# EasyEDA Pro project ProProject_FYP_2025-03-13.epro

# Schematic schematic1
Create Date: 2024-09-28; Page Name: P1; Project Name: FYP; Schematic Name: schematic1; Update Date: 2024-12-18; Company: 专业综合设计2024-1B组; Drawed: 张硕; Page Size: 张硕; Part Number: none; Reviewed: zs; Version: V2.0
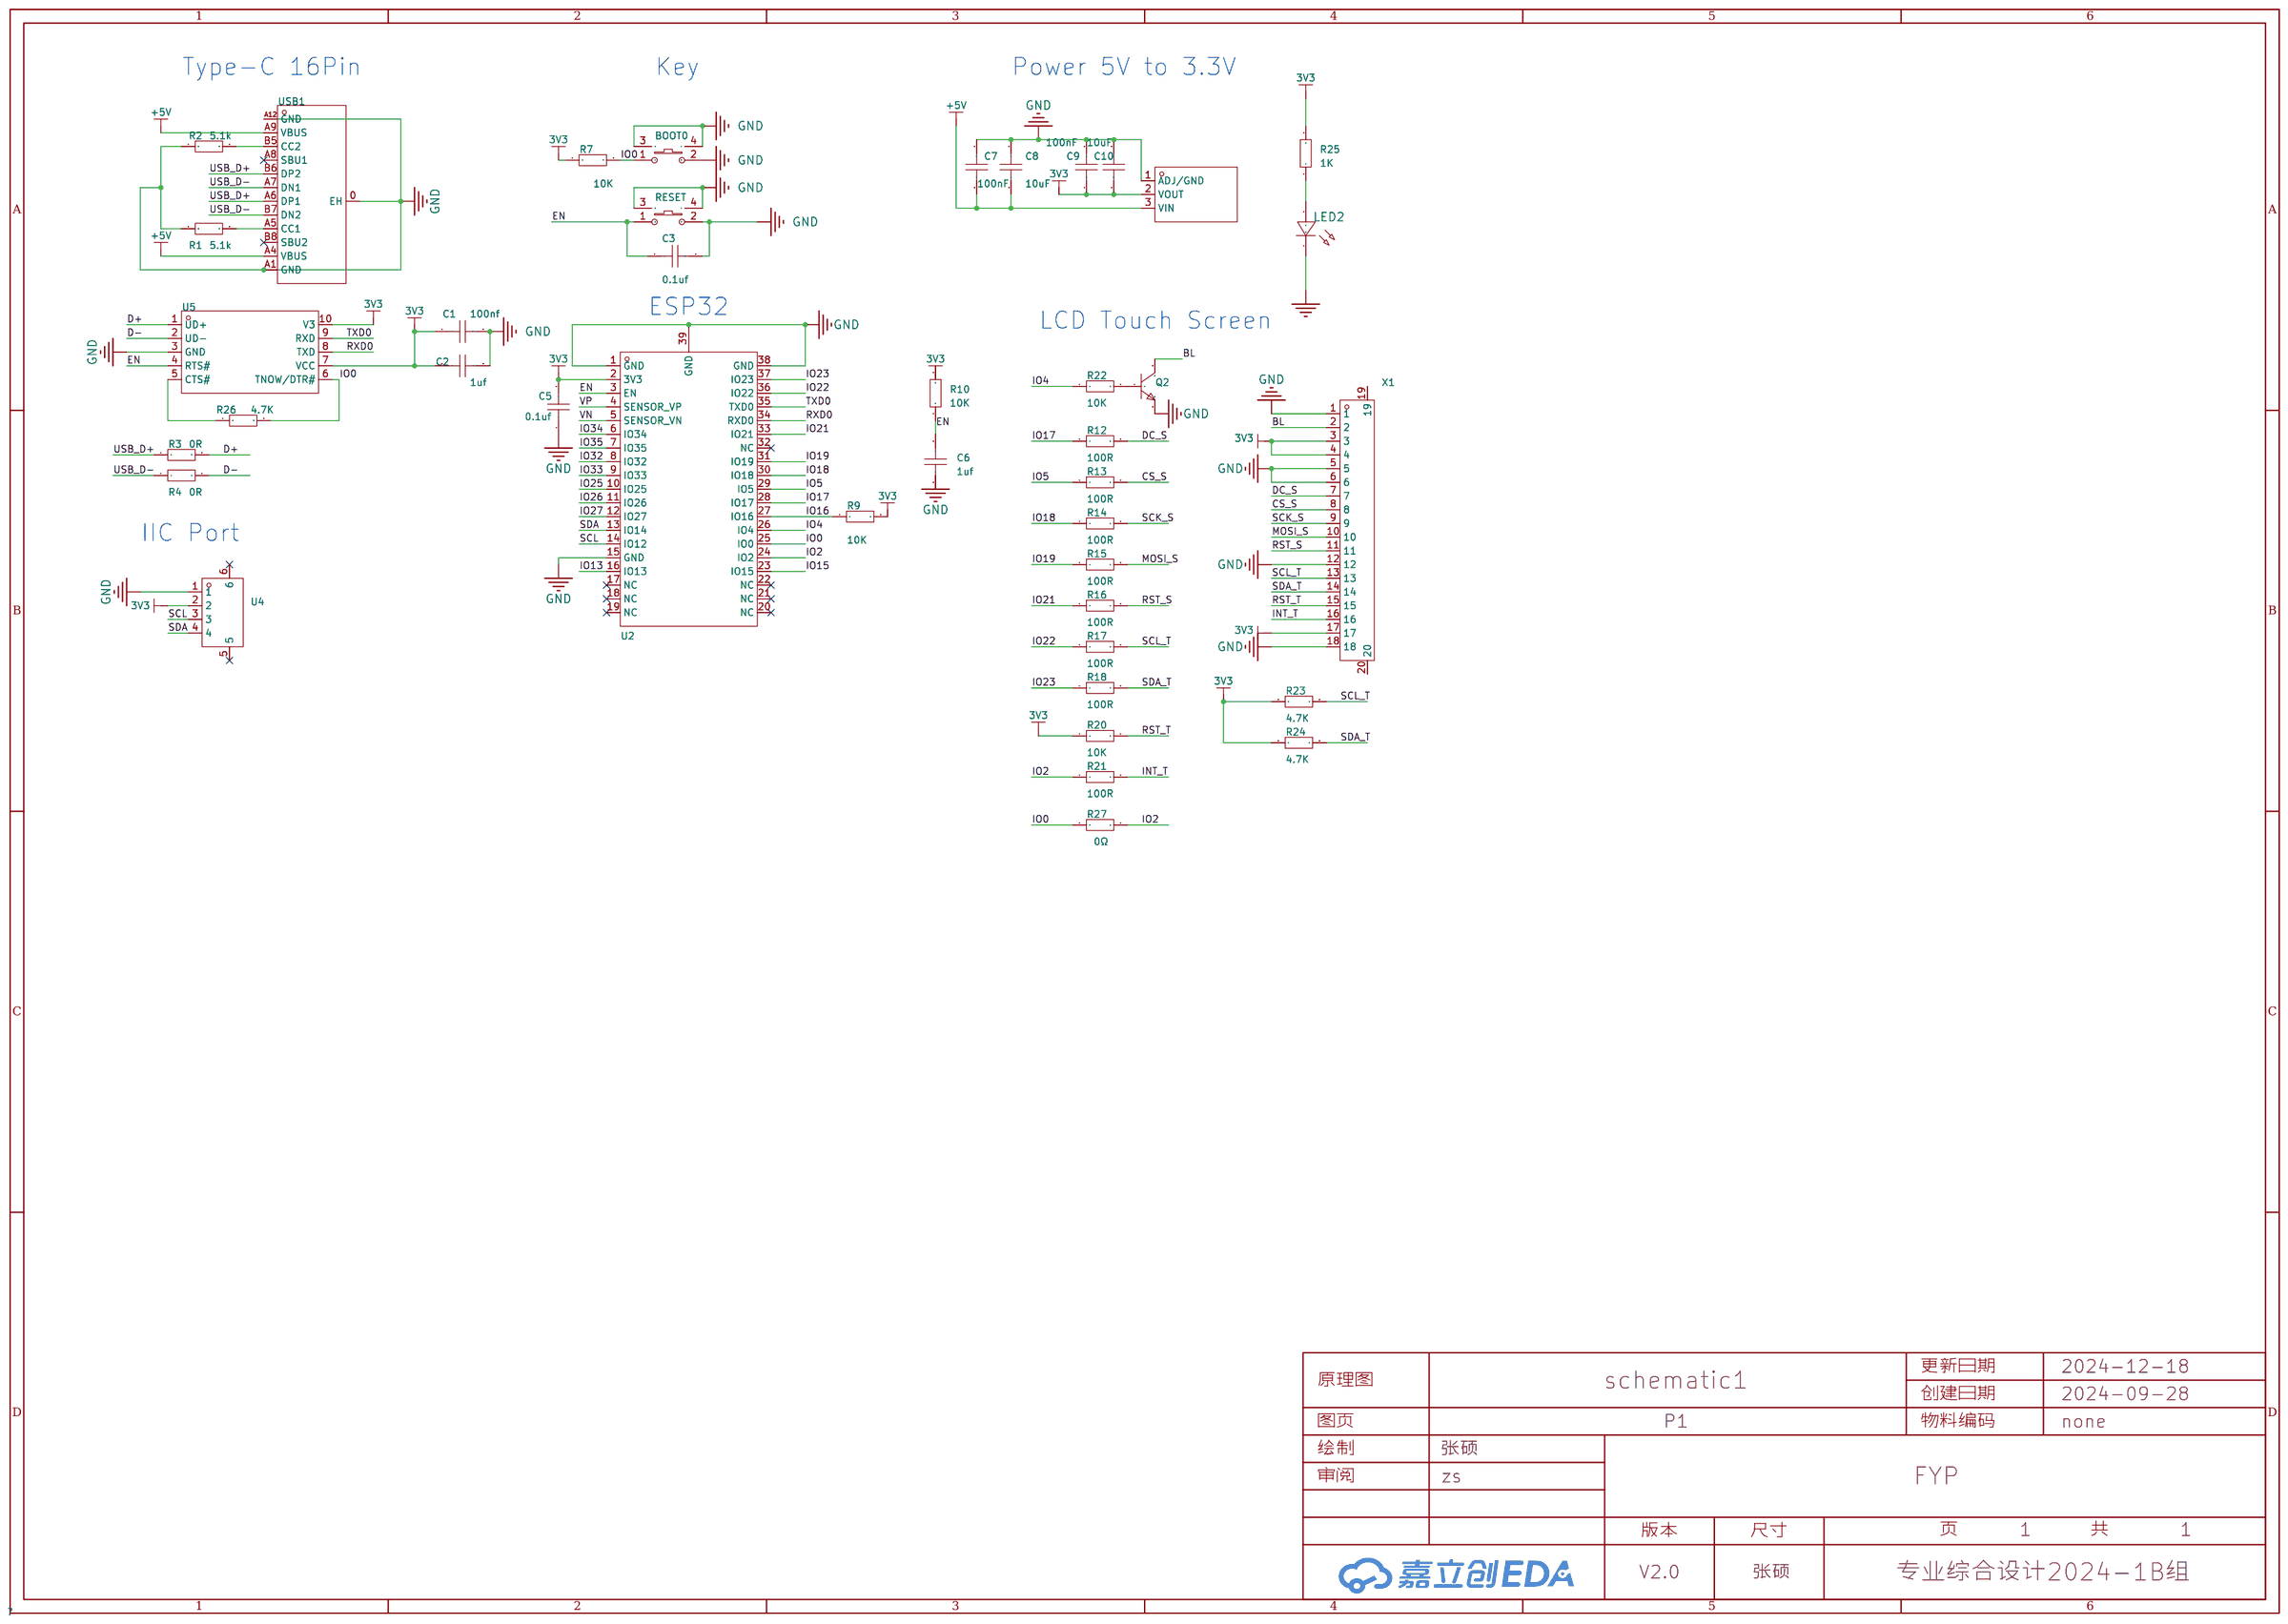
[diagram p0: schematic sheet]

## Parts
BOOT0  TS24CA 250gf 013  [SW-SMD_L4.7-W3.5-P3.35-EH]
C1  100nf  [C0603]
C2  1uf  [C0603]
C3  0.1uf  [C0603]
C5  0.1uf  [C0603]
C6  1uf  [C0603]
C7  100nF  [C0603]
C8  10uF  [C0603]
C9  100nF  [C0603]
C10  10uF  [C0603]
LED2  -  [LED_0603]
Q2  -  [S8050_SOT-23]
Q4  AMS1117-3.3V  [SOT-89-3_L4.5-W2.5-P1.50-LS4.2-BR]
R1  5.1k  [R0603]
R2  5.1k  [R0603]
R3  0R  [R0603]
R4  0R  [R0603]
R7  10K  [R0603]
R9  10K  [R0603]
R10  10K  [R0603]
R12  100R  [R0603]
R13  100R  [R0603]
R14  100R  [R0603]
R15  100R  [R0603]
R16  100R  [R0603]
R17  100R  [R0603]
R18  100R  [R0603]
R20  10K  [R0603]
R21  100R  [R0603]
R22  10K  [R0603]
R23  4.7K  [R0603]
R24  4.7K  [R0603]
R25  1K  [R0603]
R26  4.7K  [R0603]
R27  0Ω  [R0603]
RESET  TS24CA 250gf 013  [SW-SMD_L4.7-W3.5-P3.35-EH]
U2  ESP32-WROOM-32E-N4  [WIFI-SMD_ESP32-WROOM-32E]
U4  WAFER-GH1.25-4PWB  [CONN-SMD_4P-P1.25_XUNPU_WAFER-GH1.25-4PWB]
U5  CH340X  [MSOP-10_L3.0-W3.0-P0.50-LS5.0-BL]
USB1  TYPE-C 16P QTWT  [USB-TYPE-C-SMD_TYPE-C-16P-QTWT]
X1  AFC07-S18FCA-00  [FPC-SMD_AFC07-S18FCA-00]

## Library data of the parts
BOOT0 RESET = TS24CA 250gf 013: 电路结构:单刀单掷;按钮形状:矩形按钮;作用力:250gf;安装方式:卧贴;开关长度:4.55mm;开关宽度:1.8mm;开关高度:3.5mm;带支架:不带;触点电流:50mA;额定电压(AC):-;额定电压(DC):12V;额定功率:0.6W;绝缘电阻:100MΩ;带灯:无;机械寿命:3万次;; LCSC Part Name: 2*4*3.5mm半包小贝贝TS-018小侧按键m165蓝牙耳机开关 250gf; Supplier Part: C5373430; Manufacturer: SHOU HAN(首韩); Supplier Footprint: SMD; JLCPCB Part Class: 扩展库; Datasheet: https://atta.szlcsc.com/upload/public/pdf/source/20230321/913029B0FB0CD391AF5EFD51697D8EC4.pdf; Supplier: LCSC; Circuit: 单刀单掷; Actuator Style: 矩形按钮; Operating Force: 250gf; Mounting Style: 卧贴; Switch Length: 4.55mm; Switch Width: 1.8mm; Switch Height: 3.5mm; Strike Gundam: 不带; Contact Current: 50mA; Voltage Rating (DC): 12V; Power Rating: 0.6W; Insulation Resistance: 100MΩ; Actuator/Cap Color: 黑色; With Lamp: 无; Mechanical Life: 3万次; Operating Temperature: -40℃~+85℃
C1-C3 C5 C6 R1-R4 R7 R9 R10 R12-R18 R20-R27 = Res_0603: Supplier Footprint: 0603
C7-C10 = CAP_0603: Supplier Footprint: 0603
LED2 = LED_0603-R: Supplier Footprint: 0603
Q2 = S8050_SOT_NPN: Supplier Footprint: SOT-23
Q4 = AMS1117-3.3V_C5120796: 输出类型:固定;最大输入电压:18V;输出电压:3.3V;最大输出电流:1A;输出极性:正极;; LCSC Part Name: 输入18V 输出3.3V 1A; Supplier Part: C5120796; Manufacturer: MSKSEMI(美森科); Supplier Footprint: SOT-89; JLCPCB Part Class: 扩展库; Datasheet: https://atta.szlcsc.com/upload/public/pdf/source/20220727/5E62EAC46FFFF83337622C0FBE1B6BF8.pdf; Supplier: LCSC; Output Type: 固定; Maximum Input Voltage: 18V; Output Voltage: 3.3V; MAX Output Current: 1A; Dropout Voltage: 1.4V@(1A); standby current: 12mA; Operating Temperature: 0℃~+125℃; Output Polarity: 正极; Number of Outputs: 1
U2 = ESP32-WROOM-32E-N4: ESP32-WROOM-32E 集成 ESP32-D0WD-V3 芯片，具有高的稳定性和安全性能。; LCSC Part Name: 通用型Wi-Fi+BT+BLE MCU模组; Supplier Part: C701341; Manufacturer: ESPRESSIF(乐鑫); Supplier Footprint: SMD,18x25.5mm; JLCPCB Part Class: 扩展库; Datasheet: https://atta.szlcsc.com/upload/public/pdf/source/20220601/0020821B65DE5740BBACA5FACC5CF3B6.pdf; Supplier: LCSC
U4 = WAFER-GH1.25-4PWB: 插针结构:1x4P;间距:1.25mm;安装方式:卧贴;参考系列:GH;总PIN数:4P;排数:1;每排PIN数:4;额定电流:1A;工作温度范围:-25℃~+85℃;; LCSC Part Name: 1x4P 间距:1.25mm 卧贴 系列:GH; Supplier Part: C3029379; Manufacturer: XUNPU(讯普); Supplier Footprint: SMD,P=1.25mm,卧贴; JLCPCB Part Class: Extended Part; Datasheet: https://atta.szlcsc.com/upload/public/pdf/source/20220527/CB8773BFB0913C3B8ABD62CB38BA101A.pdf; Supplier: LCSC; Pins Structure: 1x4P; Pitch: 1.25mm; Mounting Style: 卧贴; Reference Series: GH; Number of Pins: 4P; Number of Rows: 1; Number of PINs Per Row: 4; Current Rating (Max): 1A; Operating Temperature Range: -25℃~+85℃
U5 = CH340X: Supplier Part: C3035748; Manufacturer: WCH(南京沁恒); Supplier Footprint: MSOP-10; JLCPCB Part Class: 扩展库; Datasheet: https://atta.szlcsc.com/upload/public/pdf/source/20230530/6E401E9554E9F5311886CC8B3F89B62E.pdf; Supplier: LCSC
USB1 = TYPE-C 16P QTWT: 连接器类型:Type-C;标准:USB 3.1;公母:母;安装方式:卧贴;触点数量:16P;端口数量:1;额定电流 - 电源:3A;触头材质:-;触头镀层:-;工作温度范围:-25℃~+85℃;焊接温度(最大值):-;; LCSC Part Name: Type-C 母 卧贴; Supplier Part: C5187472; Manufacturer: SHOU HAN(首韩); Supplier Footprint: SMD; JLCPCB Part Class: 扩展库; Datasheet: https://atta.szlcsc.com/upload/public/pdf/source/20220929/9CA39B32C19F2C1116A695DA9353B6B2.pdf; Supplier: LCSC; Connector Type: Type-C; Standard: USB 3.1; Gender: 母; Mounting Style: 卧贴; Number of Contacts: 16P; Number of Ports: 1; Current Rating - Power (Max): 3A; Operating Temperature Range: -25℃~+85℃; Rated Voltage (Max): 5V; Connect-Disconnect Life: 1万次; Core Colour: 黑色
X1 = AFC07-S18FCA-00: 锁定特性:抽屉式;触点类型:下接;触点数量:18P;间距:0.5mm;安装类型:卧贴;工作温度范围:-;; LCSC Part Name: 间距:0.5mm P数:18P 抽屉式 下接; Supplier Part: C262564; Manufacturer: JS(钜硕电子); Supplier Footprint: SMD,P=0.5mm,卧贴; JLCPCB Part Class: 扩展库; Datasheet: https://atta.szlcsc.com/upload/public/pdf/source/20190726/C11047_78689421E6D6672DE8D11ECCF89B3729.pdf; Supplier: LCSC; Locking Feature: 抽屉式; Contact Type: 下接; Number of Contacts: 18P; Pitch: 0.5mm; Mounting Type: 卧贴; FFC, FCB Thickness: 0.3mm; Height Above Board: 2mm

## Nets
3V3: C1.1 C2.1 C5.2 C9.1 C10.1 Q4.2(VOUT) R7.1 R9.2 R10.2 R20.1 R23.1 R24.1 R25.2 U2.2(3V3) U4.2 U5.7(VCC) U5.10(V3) X1.3 X1.4 X1.17
+5V: C7.1 C8.1 Q4.3(VIN) USB1.A4(VBUS) USB1.A9(VBUS)
GND: BOOT0.2 BOOT0.3 BOOT0.4 C1.2 C2.2 C3.2 C5.1 C6.2 C7.2 C8.2 C9.2 C10.2 LED2.1(C) Q2.2 Q4.1(ADJ/GND) R1.1 R2.1 RESET.2 RESET.3 RESET.4 U2.1(GND) U2.15(GND) U2.38(GND) U2.39(GND) U4.1 U5.3(GND) USB1.0(EH) USB1.A1(GND) USB1.A12(GND) X1.1 X1.5 X1.6 X1.12 X1.18
BL: Q2.3 X1.2
CS_S: R13.2 X1.8
D+: R3.2 U5.1(UD+)
D-: R4.2 U5.2(UD-)
DC_S: R12.2 X1.7
EN: C3.1 C6.1 R10.1 RESET.1 U2.3(EN) U5.4(RTS#)
INT_T: R21.2 X1.16
IO0: BOOT0.1 R7.2 R26.2 R27.1 U2.25(IO0) U5.6(TNOW/DTR#)
IO2: R21.1 R27.2 U2.24(IO2)
IO4: R22.1 U2.26(IO4)
IO5: R13.1 U2.29(IO5)
IO13: U2.16(IO13)
IO15: U2.23(IO15)
IO16: R9.1 U2.27(IO16)
IO17: R12.1 U2.28(IO17)
IO18: R14.1 U2.30(IO18)
IO19: R15.1 U2.31(IO19)
IO21: R16.1 U2.33(IO21)
IO22: R17.1 U2.36(IO22)
IO23: R18.1 U2.37(IO23)
IO25: U2.10(IO25)
IO26: U2.11(IO26)
IO27: U2.12(IO27)
IO32: U2.8(IO32)
IO33: U2.9(IO33)
IO34: U2.6(IO34)
IO35: U2.7(IO35)
MOSI_S: R15.2 X1.10
RST_S: R16.2 X1.11
RST_T: R20.2 X1.15
RXD0: U2.34(RXD0) U5.8(TXD)
SCK_S: R14.2 X1.9
SCL: U2.14(IO12) U4.3
SCL_T: R17.2 R23.2 X1.13
SDA: U2.13(IO14) U4.4
SDA_T: R18.2 R24.2 X1.14
TXD0: U2.35(TXD0) U5.9(RXD)
USB_D+: R3.1 USB1.A6(DP1) USB1.B6(DP2)
USB_D-: R4.1 USB1.A7(DN1) USB1.B7(DN2)
VN: U2.5(SENSOR_VN)
VP: U2.4(SENSOR_VP)
$1N21260: R1.2 USB1.A5(CC1)
$1N21335: R2.2 USB1.B5(CC2)
$1N24462: LED2.2(A) R25.1
$1N26601: Q2.1 R22.2
$1N40349: R26.1 U5.5(CTS#)

Not connected (* = marked no-connect by the designer): U2 17(NC)* 18(NC)* 19(NC)* 20(NC)* 21(NC)* 22(NC)* 32(NC)*; U4 5* 6*; USB1 A8(SBU1)* B8(SBU2)*; X1 19 20

## Notes on the sheet
- Type-C 16Pin
- Key
- Power 5V to 3.3V
- ESP32
- LCD Touch Screen
- IIC Port

# Board PCB1
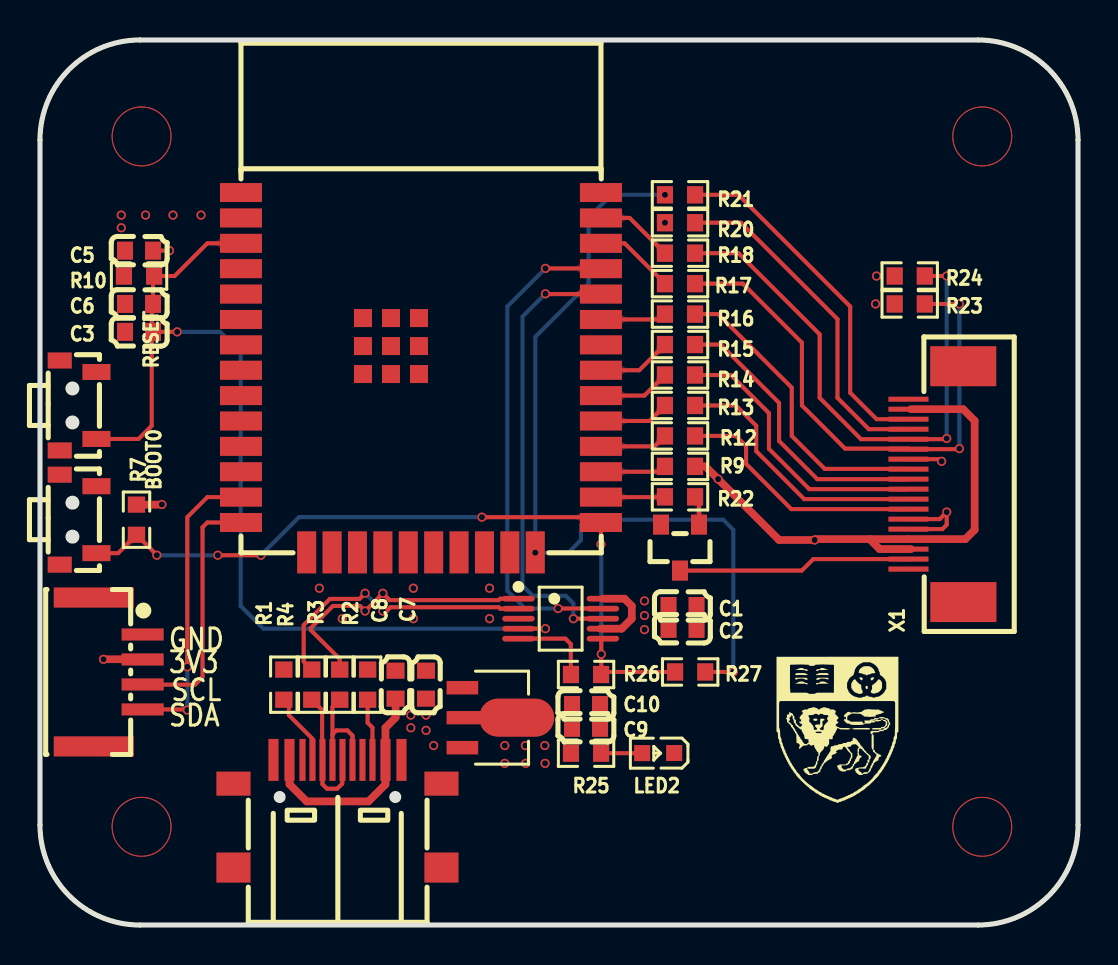
[diagram p1: board, top side]
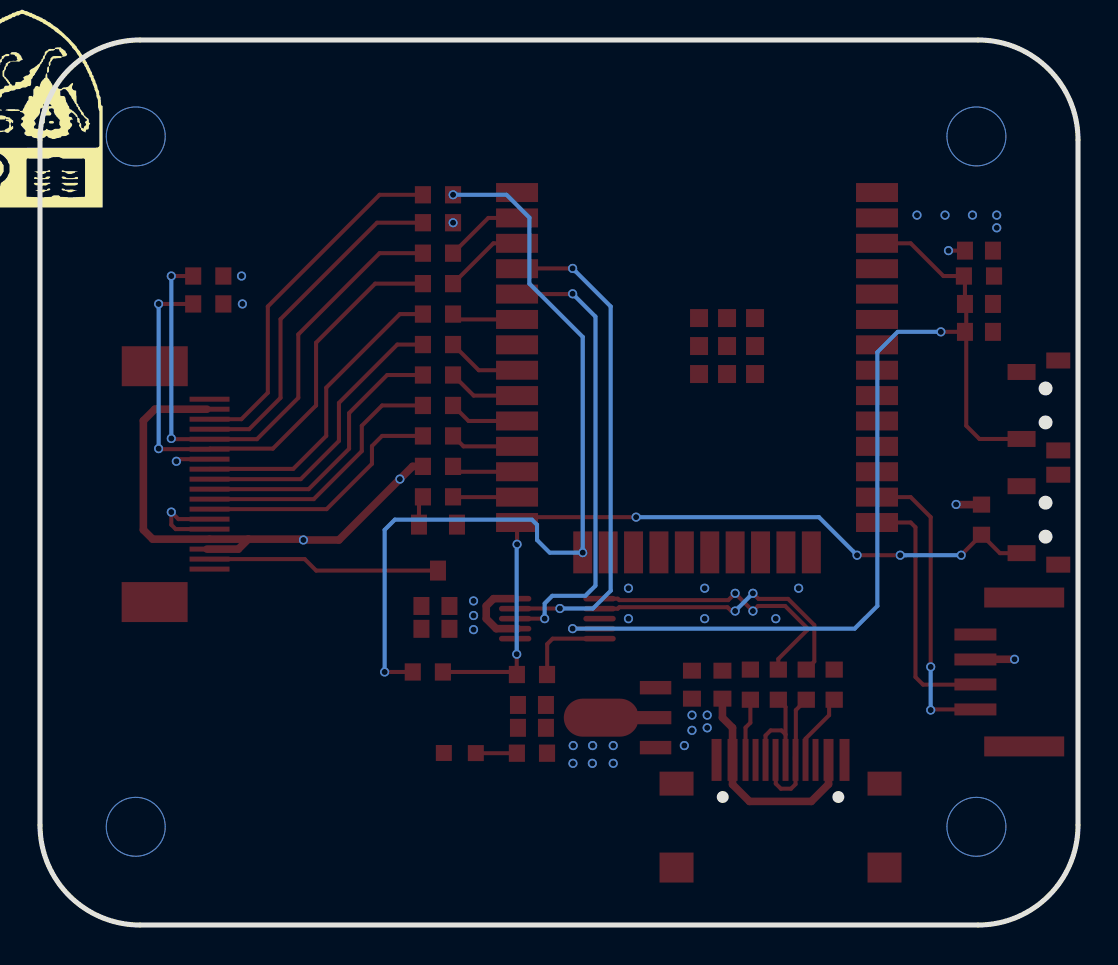
[diagram p2: board, bottom side, seen from below]

Outline 51.91 x 44.29 mm; copper layers: Top Layer, GND, VCC, Bottom Layer. Coordinates in mm from the lower left corner of the outline.
Outline path: 0,39.29 0,5 arc(1.46,1.46) 5,0 46.91,0 arc(50.44,1.46) 51.91,5 51.91,39.29 arc(50.44,42.82) 46.91,44.29 5,44.29 arc(1.46,42.82) 0,39.29
Stack: Top Layer 0.035mm 外层铜厚1oz / Dielectric1 0.2104mm 7628 RC49% 8.6mil / GND 0.035mm - / Dielectric2 1.065mm 1.1mm H/HOZ 含铜 / VCC 0.035mm - / Dielectric3 0.2104mm 7628 RC49% 8.6mil / Bottom Layer 0.035mm 外层铜厚1oz

## Design rules (mm)
net USB_D+: USBD
net USB_D-: USBD
net D+: D
net D-: D
template: 自定义配置
spacing copperThickness1oz (default): track to track 0.152, other pairs 0.152 to 0.3
spacing copperThickness2oz: track to track 0.203, other pairs 0.152 to 0.3
track width copperThickness1oz (default): min 0.203, default 0.203, max 2.54
track width copperThickness2oz: min 0.203, default 0.254, max 2.54
differential pair differentialPair (default): width min 0.203, default 0.203, max 2.54; gap min 0.152, default 0.152
via viaSize (default): diameter min 0.457, default 0.457, max 10; hole min 0.3, default 0.305, max 6.299

## Placement (name value [footprint] x y rotation side)
BOOT0  TS24CA 250gf 013  [SW-SMD_L4.7-W3.5-P3.35-EH]  1.91 20.28 90 top
C1  100nf  [C0603]  32.13 15.96 0 top
C2  1uf  [C0603]  32.13 14.82 0 top
C3  0.1uf  [C0603]  4.95 29.68 180 top
C5  0.1uf  [C0603]  4.95 33.74 180 top
C6  1uf  [C0603]  4.95 31.08 180 top
C7  100nF  [C0603]  19.3 12.03 90 top
C8  10uF  [C0603]  17.78 12.03 90 top
C9  100nF  [C0603]  27.31 9.87 0 top
C10  10uF  [C0603]  27.31 11.01 0 top
LED2  -  [LED_0603]  30.86 8.6 180 top
Q2  -  [S8050_SOT-23]  32.13 18.89 90 top
Q4  AMS1117-3.3V  [SOT-89-3_L4.5-W2.5-P1.50-LS4.2-BR]  22.48 10.38 180 top
R1  5.1k  [R0603]  12.19 12.03 270 top
R2  5.1k  [R0603]  16.38 12.03 270 top
R3  0R  [R0603]  14.99 12.03 90 top
R4  0R  [R0603]  13.59 12.03 90 top
R7  10K  [R0603]  4.83 20.28 270 top
R9  10K  [R0603]  32 22.95 0 top
R10  10K  [R0603]  4.95 32.47 180 top
R12  100R  [R0603]  32 24.47 0 top
R13  100R  [R0603]  32 26 0 top
R14  100R  [R0603]  32 27.52 0 top
R15  100R  [R0603]  32 29.05 0 top
R16  100R  [R0603]  32 30.57 0 top
R17  100R  [R0603]  32 32.09 0 top
R18  100R  [R0603]  32 33.62 0 top
R20  10K  [R0603]  32 35.14 0 top
R21  100R  [R0603]  32 36.54 0 top
R22  10K  [R0603]  32 21.43 0 top
R23  4.7K  [R0603]  43.49 31.08 0 top
R24  4.7K  [R0603]  43.49 32.47 0 top
R25  1K  [R0603]  27.31 8.6 180 top
R26  4.7K  [R0603]  27.31 12.54 0 top
R27  0Ω  [R0603]  32.51 12.66 0 top
RESET  TS24CA 250gf 013  [SW-SMD_L4.7-W3.5-P3.35-EH]  1.91 26 90 top
U2  ESP32-WROOM-32E-N4  [WIFI-SMD_ESP32-WROOM-32E]  19.05 27.65 270 top
U4  WAFER-GH1.25-4PWB  [conn-smd_4p-p1.25_xunpu_wafer-gh1.25-4pwb]  3.56 12.66 270 top
U5  CH340X  [MSOP-10_L3.0-W3.0-P0.50-LS5.0-BL]  26.03 15.33 270 top
USB1  TYPE-C 16P QTWT  [usb-type-c-smd_type-c-16p-qtwt]  14.88 5.19 0 top
X1  AFC07-S18FCA-00  [fpc-smd_afc07-s18fca-00]  45.09 22.06 90 top

## Footprints (pads in the part's own frame, mm; a bottom-side part is the same pattern mirrored in y, then rotated)
C0603
  rect 0.8x0.9 smd: 1(-0.7,0) 2(0.7,0)
conn-smd_4p-p1.25_xunpu_wafer-gh1.25-4pwb
  rect 0.6x2.1 smd: 1(-1.875,1.575) 2(-0.625,1.575) 3(0.625,1.575) 4(1.875,1.575)
  rect 1x4 smd: 5(3.725,-0.866) 6(-3.725,-0.866)
fpc-smd_afc07-s18fca-00
  rect 0.25x2 smd: 1(-4.25,1.658) 2(-3.75,1.658) 3(-3.25,1.658) 4(-2.75,1.658) 5(-2.25,1.658) 6(-1.75,1.658) 7(-1.25,1.658) 8(-0.75,1.658) 9(-0.25,1.658) 10(0.25,1.658) 11(0.75,1.658) 12(1.25,1.658) 13(1.75,1.658) 14(2.25,1.658) 15(2.75,1.658) 16(3.25,1.658) 17(3.75,1.658) 18(4.25,1.658)
  rect 2x3.3 smd: 19(5.901,-1.081) 20(-5.901,-1.089)
LED_0603
  rect 0.8x0.8 smd: 1(-0.851,-0.01) 2(0.75,-0.005)
MSOP-10_L3.0-W3.0-P0.50-LS5.0-BL
  oval 0.28x1.62 smd: 1(-1,-2.11) 2(-0.5,-2.11) 3(0,-2.11) 4(0.5,-2.11) 5(1,-2.11) 6(1,2.11) 7(0.5,2.11) 8(0,2.11) 9(-0.5,2.11) 10(-1,2.11)
R0603
  rect 0.806x0.864 smd: 1(-0.753,0) 2(0.753,0)
S8050_SOT-23
  rect 1x0.8 smd: 1(1.15,-0.823) 2(1.15,1.077) 3(-1.15,0.127)
SOT-89-3_L4.5-W2.5-P1.50-LS4.2-BR
  rect 1.575x0.672 smd: 1(1.356,-1.5) 3(1.356,1.5)
  custom 5.377x1.9 smd: 2(-1.356,0)
SW-SMD_L4.7-W3.5-P3.35-EH
  rect 0.8x1.4 smd: 1(-1.675,-0.917) 2(1.675,-0.917)
  rect 0.8x1.2 smd: 3(-2.25,0.917) 4(2.25,0.917)
usb-type-c-smd_type-c-16p-qtwt
  rect 1.7x1.2 smd: 0(-5.2,1.891) 0(5.2,1.891)
  rect 1.7x1.5 smd: 0(-5.2,-2.309) 0(5.2,-2.309)
  rect 0.5x2.1 smd: A1(-3.2,3.077) A4(-2.4,3.077) A9(2.4,3.077) A12(3.2,3.077)
  rect 0.3x2.1 smd: A5(-1.25,3.077) A6(-0.25,3.077) A7(0.25,3.077) A8(1.25,3.077) B5(1.75,3.077) B6(0.75,3.077) B7(-0.75,3.077) B8(-1.75,3.077)
WIFI-SMD_ESP32-WROOM-32E
  rect 0.95x2.1 smd: 1(-9.002,-9) 2(-7.732,-9) 3(-6.463,-9) 4(-5.192,-9) 5(-3.922,-9) 6(-2.652,-9) 7(-1.383,-9) 8(-0.113,-9) 9(1.157,-9) 10(2.428,-9) 11(3.697,-9) 12(4.968,-9) 13(6.237,-9) 14(7.508,-9) 25(7.508,9) 26(6.237,9) 27(4.968,9) 28(3.697,9) 29(2.428,9) 30(1.157,9) 31(-0.113,9) 32(-1.383,9) 33(-2.652,9) 34(-3.922,9) 35(-5.192,9) 36(-6.463,9) 37(-7.732,9) 38(-9.002,9)
  rect 2.1x0.95 smd: 15(9.002,-5.715) 16(9.002,-4.445) 17(9.002,-3.175) 18(9.002,-1.905) 19(9.002,-0.635) 20(9.002,0.635) 21(9.002,1.905) 22(9.002,3.175) 23(9.002,4.445) 24(9.002,5.715)
  rect 0.9x0.9 smd: 39(-2.721,-0.1) 39(-2.721,-1.5) 39(-2.721,-2.9) 39(-1.321,-0.1) 39(-1.321,-1.5) 39(-1.321,-2.9) 39(0.079,-0.1) 39(0.079,-1.5) 39(0.079,-2.9)

## Nets
As in the schematic.

Pads without a net: U2 17 18 19 20 21 22 32; U4 5 6; USB1 A8 B8; X1 19 20

## Via types
v1: diameter 3, hole 2.9, Top Layer to Bottom Layer, 4 vias
v2: diameter 0.457, hole 0.305, Top Layer to Bottom Layer, 60 vias

## Routing (per net, layer and track width the routed paths; a pad name or vN(x,y) marks a point on that pad's centre or on a via; arc(x,y) is an arc through that point)
3V3: length 34.1
  Top Layer w0.381: 41.48,19.31 38.78,19.31 v2(38.73,19.27) 36.96,19.27 v2(33.91,22.31) 33.27,22.95 R9.2 ; 41.48,19.31 46.27,19.31 46.74,19.77 46.74,25.23 46.16,25.81 43.55,25.81 ; 41.48,19.31 41.98,18.81 43.55,18.81 ; U4.2 5.12,13.3 v2(3.17,13.3) ; 28.02,14.83 U5.7 29.09,14.83 29.59,15.33 29.59,15.96 29.23,16.33 U5.10 ; R7.1 6.09,21.04 v2(6.1,21.04)
  vias: v2(4.06,35.52) v2(4.06,34.89) v2(5.28,35.52) v2(6.65,35.52) v2(8.05,35.52) v2(23.24,8.98) v2(23.24,8.09) v2(24.27,8.98) v2(24.29,8.09) v2(25.24,8.98) v2(25.26,8.09) v2(30.23,16.22) v2(30.23,15.49) v2(30.23,14.78) v2(31.25,35.14) v2(41.83,32.47) v2(41.78,31.08)
+5V: length 11.2
  Top Layer w0.381: 17.78,11.33 17.78,10.38 17.28,9.87 USB1.A9 17.28,7.03 16.43,6.19 13.34,6.19 12.47,7.05 USB1.A4
  vias: v2(18.54,10.5) v2(18.54,9.87) v2(19.3,10.5) v2(19.3,9.74) v2(19.69,8.98)
GND: length 7.2
  Top Layer w0.203: 43.43,23.31 44.98,23.31 v2(45.09,23.2) ; 43.43,19.81 45.12,19.81 45.34,20.03 v2(45.34,20.66) 44.99,20.31 43.43,20.31 ; C5.1 v2(6.48,33.74)
  vias: v2(13.97,16.85) v2(15.11,15.33) v2(18.67,16.85) v2(18.67,15.33) v2(22.48,16.85) v2(22.48,15.33)
(no net):
  vias: v1(5.08,39.46) v1(5.08,4.92) v1(47.12,39.46) v1(47.12,4.92)
BL: length 11.7
  Top Layer w0.203: Q2.3 38.09,17.73 38.67,18.31 43.43,18.31 43.43,18.32
CS_S: length 13.4
  Top Layer w0.203: R13.2 34.8,26 35.81,24.98 35.81,23.71 38.22,21.31 43.43,21.31
D+: length 14.2
  Top Layer w0.203: 23.93,16.33 23.01,16.33 22.94,16.26 17.49,16.26 v2(17.15,16.6) v2(16.26,15.71) 16,15.96 14.65,15.96 13.54,14.86 13.54,14.76 14.99,13.31 R3.2
D-: length 14.3
  Top Layer w0.203: v2(16.26,16.6) 15.98,16.32 14.5,16.32 13.19,15.01 13.19,13.18 R4.2 ; 23.93,15.83 23.01,15.83 22.94,15.9 17.53,15.9 17.34,15.71 v2(17.15,15.71)
  Bottom Layer w0.203: v2(16.26,16.6) v2(17.15,15.71)
DC_S: length 12.7
  Top Layer w0.203: R12.2 34.8,24.47 35.31,23.97 35.31,23.08 37.57,20.81 43.43,20.81
EN: length 50
  Top Layer w0.203: 23.93,14.83 v2(25.27,14.83) ; C3.1 v2(6.86,29.68) ; 9.92,34.11 8.37,34.11 6.73,32.47 R10.1 5.65,32.42 C6.1 5.59,31.01 5.59,24.98 4.93,24.32 RESET.1
  Bottom Layer w0.203: v2(25.27,14.83) 11.17,14.83 10.03,15.96 10.03,28.66 9.02,29.68 v2(6.86,29.68)
INT_T: length 17.8
  Top Layer w0.203: R21.2 34.93,36.54 40.51,30.95 40.51,26.63 41.84,25.31 43.43,25.31
IO0: length 39.3
  Top Layer w0.203: v2(22.1,20.41) 27.78,20.41 U2.25 28.05,19.03 28.07,19.01 ; U5.6 28.07,14.25 v2(28.07,13.55) 28.07,12.54 ; 28.07,12.54 R26.2 ; 28.07,12.54 28.19,12.66 R27.1 ; v2(5.84,18.5) 5.84,18.51 R7.2 3.9,18.61 2.7,18.61 ; v2(8.89,18.5) v2(11.05,18.5)
  Bottom Layer w0.203: v2(5.84,18.5) v2(8.89,18.5) ; v2(28.07,13.55) 28.07,19.03 v2(28.05,19.05) ; v2(11.05,18.5) 12.95,20.41 v2(22.1,20.41)
IO2: length 41.9
  Top Layer w0.203: R27.2 v2(34.67,12.66)
  Bottom Layer w0.203: v2(31.25,36.54) 28.57,36.54 27.43,35.4 27.43,32.09 24.76,29.43 v2(24.76,18.63) 26.42,18.63 27.05,19.27 27.05,20.03 27.31,20.28 34.16,20.28 34.67,19.77 v2(34.67,12.66)
IO4: length 3.2
  Top Layer w0.203: U2.26 31.24,21.41 R22.1
IO5: length 3.5
  Top Layer w0.203: U2.29 30.47,25.22 R13.1
IO16: length 3.3
  Top Layer w0.203: R9.1 30.98,22.68 U2.27
IO17: length 3.4
  Top Layer w0.203: R12.1 30.73,23.95 U2.28
IO18: length 3.8
  Top Layer w0.203: R14.1 30.22,26.49 27.92,26.49
IO19: length 3.9
  Top Layer w0.203: 27.92,27.76 29.97,27.76 R15.1
IO21: length 3.4
  Top Layer w0.203: 27.92,30.3 30.98,30.3 R16.1
IO22: length 4.2
  Top Layer w0.203: 27.92,34.11 29.23,34.11 R17.1
IO23: length 4.1
  Top Layer w0.203: 27.92,35.38 29.49,35.38 R18.1
MOSI_S: length 14.6
  Top Layer w0.203: 43.43,22.31 38.87,22.31 36.96,24.22 36.96,26.12 34.04,29.05 R15.2
RST_S: length 15.3
  Top Layer w0.203: 43.43,22.81 43.41,22.82 39.24,22.82 37.59,24.47 37.59,26.89 33.91,30.57 R16.2
RST_T: length 17.3
  Top Layer w0.203: 43.43,24.81 41.45,24.81 39.88,26.38 39.88,30.32 35.05,35.14 R20.2
RXD0: length 22.9
  Top Layer w0.203: U2.34 25.29,31.57 v2(25.27,31.59) ; v2(26.67,15.33) 28.02,15.33
  Bottom Layer w0.203: v2(25.27,31.59) 24.13,30.44 24.13,16.98 24.64,16.47 26.29,16.47 26.67,16.09 v2(26.67,15.33)
SCK_S: length 14.1
  Top Layer w0.203: 43.43,21.81 38.47,21.81 36.45,23.83 36.45,25.62 34.54,27.52 R14.2
SCL: length 12.7
  Top Layer w0.203: U4.3 5.14,12.03 7.75,12.03 8.13,12.41 8.13,19.9 8.37,20.14 U2.14
SCL_T: length 27.3
  Top Layer w0.203: v2(45.97,23.84) 45.95,23.81 43.43,23.81 43.4,23.84 40.26,23.84 38.1,26 38.1,29.14 35.14,32.09 32.88,32.09 ; 44.24,31.08 v2(45.97,31.08)
  Bottom Layer w0.203: v2(45.97,31.08) v2(45.97,23.84)
SDA: length 15
  Top Layer w0.203: v2(7.37,10.76) 7.34,10.79 U4.4 ; U2.13 8.37,21.41 7.37,20.41 v2(7.37,12.92)
  Bottom Layer w0.203: v2(7.37,12.92) v2(7.37,10.76)
SDA_T: length 27.5
  Top Layer w0.203: R18.2 34.93,33.62 38.99,29.55 38.99,26.38 41.06,24.31 45.3,24.31 v2(45.34,24.35) ; 44.24,32.47 v2(45.34,32.47)
  Bottom Layer w0.203: v2(45.34,32.47) v2(45.34,24.35)
TXD0: length 24.7
  Top Layer w0.203: v2(25.91,15.84) 28.01,15.84 28.02,15.83 ; U2.35 28.04,32.86 v2(25.27,32.86)
  Bottom Layer w0.203: v2(25.27,32.86) 23.37,30.95 23.37,16.73 24.26,15.84 v2(25.91,15.84)
USB_D+: length 5.6
  Top Layer w0.203: 14.62,9.54 14.62,10.91 R3.1 ; 14.62,9.54 USB1.A6 ; 14.62,9.54 14.83,9.74 15.37,9.74 15.62,9.48 USB1.B6
USB_D-: length 6.9
  Top Layer w0.203: USB1.A7 15.11,8.25 15.11,7.07 14.86,6.82 14.35,6.82 14.12,7.05 USB1.B7 14.16,8.29 14.16,8.41 14.11,8.46 14.11,10.75 R4.1
$1N21260: length 3.6
  Top Layer w0.203: USB1.A5 13.62,9.32 12.45,10.5 12.45,11.18 12.34,11.29 12.32,11.27
$1N21335: length 3.1
  Top Layer w0.203: USB1.B5 16.62,9.88 16.38,10.12 R2.2
$1N24462: length 1.9
  Top Layer w0.203: LED2.2 30.11,8.6 28.19,8.6
$1N26601: length 1.5
  Top Layer w0.203: R22.2 32.95,21.23 Q2.1
$1N40349: length 4
  Top Layer w0.203: 23.93,14.33 26.27,14.33 26.54,14.06 26.54,12.79

## Copper pours and planes (outline as drawn; the poured copper is in the pictures)
3V3 on Top Layer: 22.61,11.77 27.3,11.77 27.3,7.54 22.61,7.54
3V3 on Top Layer: 41.28,32.98 43.49,32.98 43.49,30.48 41.28,30.48
3V3 on Top Layer: 4.95,31.82 3.54,31.82 3.43,31.82 3.43,35.98 11.17,35.98 11.17,34.72 5.04,34.72 4.95,34.63
3V3 on Top Layer: 29.23,16.58 31.88,16.58 31.88,14.31 29.23,14.31
3V3 on VCC: -10.16,54.45 59.94,54.45 59.94,-13.63 -10.16,-13.63
+5V on Top Layer: 17.02,9.49 17.02,12.03 19.92,12.03 19.92,9.63 19.94,9.61 21.85,9.61 21.85,8.36 19.05,8.36 19.05,9.36 18.92,9.49
GND on Top Layer: -3.43,45.94 55.12,45.94 55.12,-4.36 -3.43,-4.36
GND on Bottom Layer: -4.95,48.1 57.53,48.1 57.53,-7.02 -4.95,-7.02
GND on GND: -7.37,50.76 58.93,50.76 58.93,-10.07 -7.37,-10.07

Small or netless copper shapes (teardrops, artwork), in the pictures only: 42 on Top Layer, 11 on Bottom Layer

## Text on the board
Top Silkscreen Layer: GND | 3V3 | SDA | SCL
